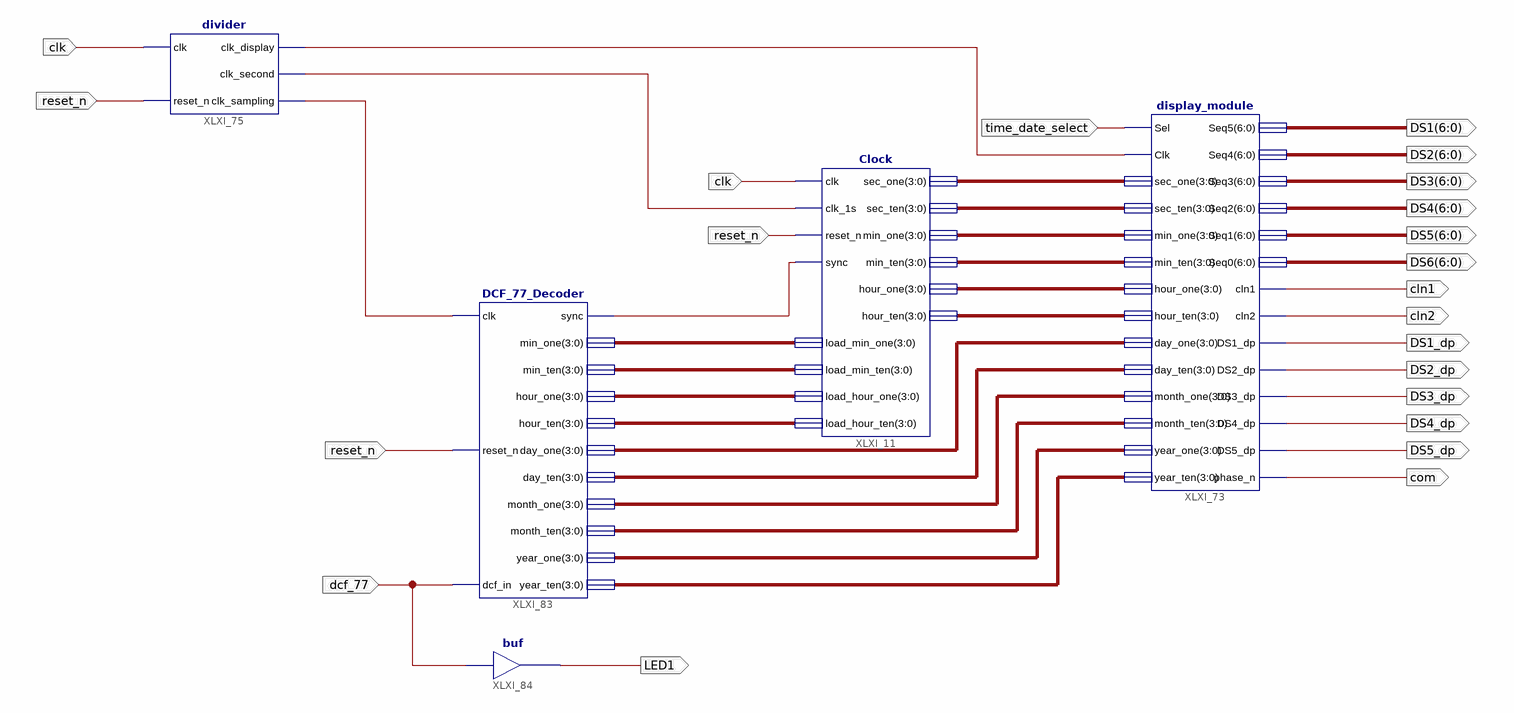
[diagram p0: schematic sheet 1]
// Xilinx ISE schematic Top_Schema.sch (xbr) as structural Verilog: 5 symbols, 19 ports
module Top_Schema (
  input  clk,
  input  time_date_select,
  input  reset_n,
  input  dcf_77,
  output [6:0] DS2,
  output [6:0] DS1,
  output [6:0] DS3,
  output [6:0] DS4,
  output [6:0] DS5,
  output [6:0] DS6,
  output cln1,
  output cln2,
  output DS1_dp,
  output DS2_dp,
  output DS3_dp,
  output DS4_dp,
  output com,
  output DS5_dp,
  output LED1
);

  wire XLXN_163, XLXN_235, XLXN_237, XLXN_238;
  wire [3:0] XLXN_75, XLXN_76, XLXN_77, XLXN_78, XLXN_83, XLXN_84, XLXN_85, XLXN_86, XLXN_87, XLXN_88,
       XLXN_89, XLXN_90, XLXN_91, XLXN_176, XLXN_217, XLXN_218;

  Clock XLXI_11 (
    .load_hour_ten(XLXN_78), .load_min_ten(XLXN_76), .load_min_one(XLXN_75), .clk(clk), .sync(XLXN_163),
    .reset_n(reset_n), .clk_1s(XLXN_237), .load_hour_one(XLXN_77), .sec_ten(XLXN_83), .sec_one(XLXN_176),
    .min_ten(XLXN_85), .min_one(XLXN_84), .hour_one(XLXN_86), .hour_ten(XLXN_87));
  display_module XLXI_73 (
    .Sel(time_date_select), .year_ten(XLXN_218), .sec_ten(XLXN_83), .month_one(XLXN_90), .hour_ten(XLXN_87),
    .day_ten(XLXN_89), .min_ten(XLXN_85), .month_ten(XLXN_91), .min_one(XLXN_84), .hour_one(XLXN_86),
    .day_one(XLXN_88), .sec_one(XLXN_176), .year_one(XLXN_217), .Clk(XLXN_235), .Seq3(DS3), .Seq5(DS1),
    .Seq4(DS2), .Seq2(DS4), .Seq1(DS5), .Seq0(DS6), .DS4_dp(DS4_dp), .DS2_dp(DS2_dp), .DS3_dp(DS3_dp),
    .DS1_dp(DS1_dp), .phase_n(com), .DS5_dp(DS5_dp), .cln2(cln2), .cln1(cln1));
  divider XLXI_75 (
    .clk(clk), .reset_n(reset_n), .clk_display(XLXN_235), .clk_second(XLXN_237), .clk_sampling(XLXN_238));
  DCF_77_Decoder XLXI_83 (
    .clk(XLXN_238), .reset_n(reset_n), .dcf_in(dcf_77), .sync(XLXN_163), .min_one(XLXN_75),
    .min_ten(XLXN_76), .hour_one(XLXN_77), .hour_ten(XLXN_78), .day_one(XLXN_88), .day_ten(XLXN_89),
    .month_one(XLXN_90), .month_ten(XLXN_91), .year_one(XLXN_217), .year_ten(XLXN_218));
  buf XLXI_84 (LED1, dcf_77);
endmodule
